# EAGLE board IGOR_1 (EAGLE 6.5.0)
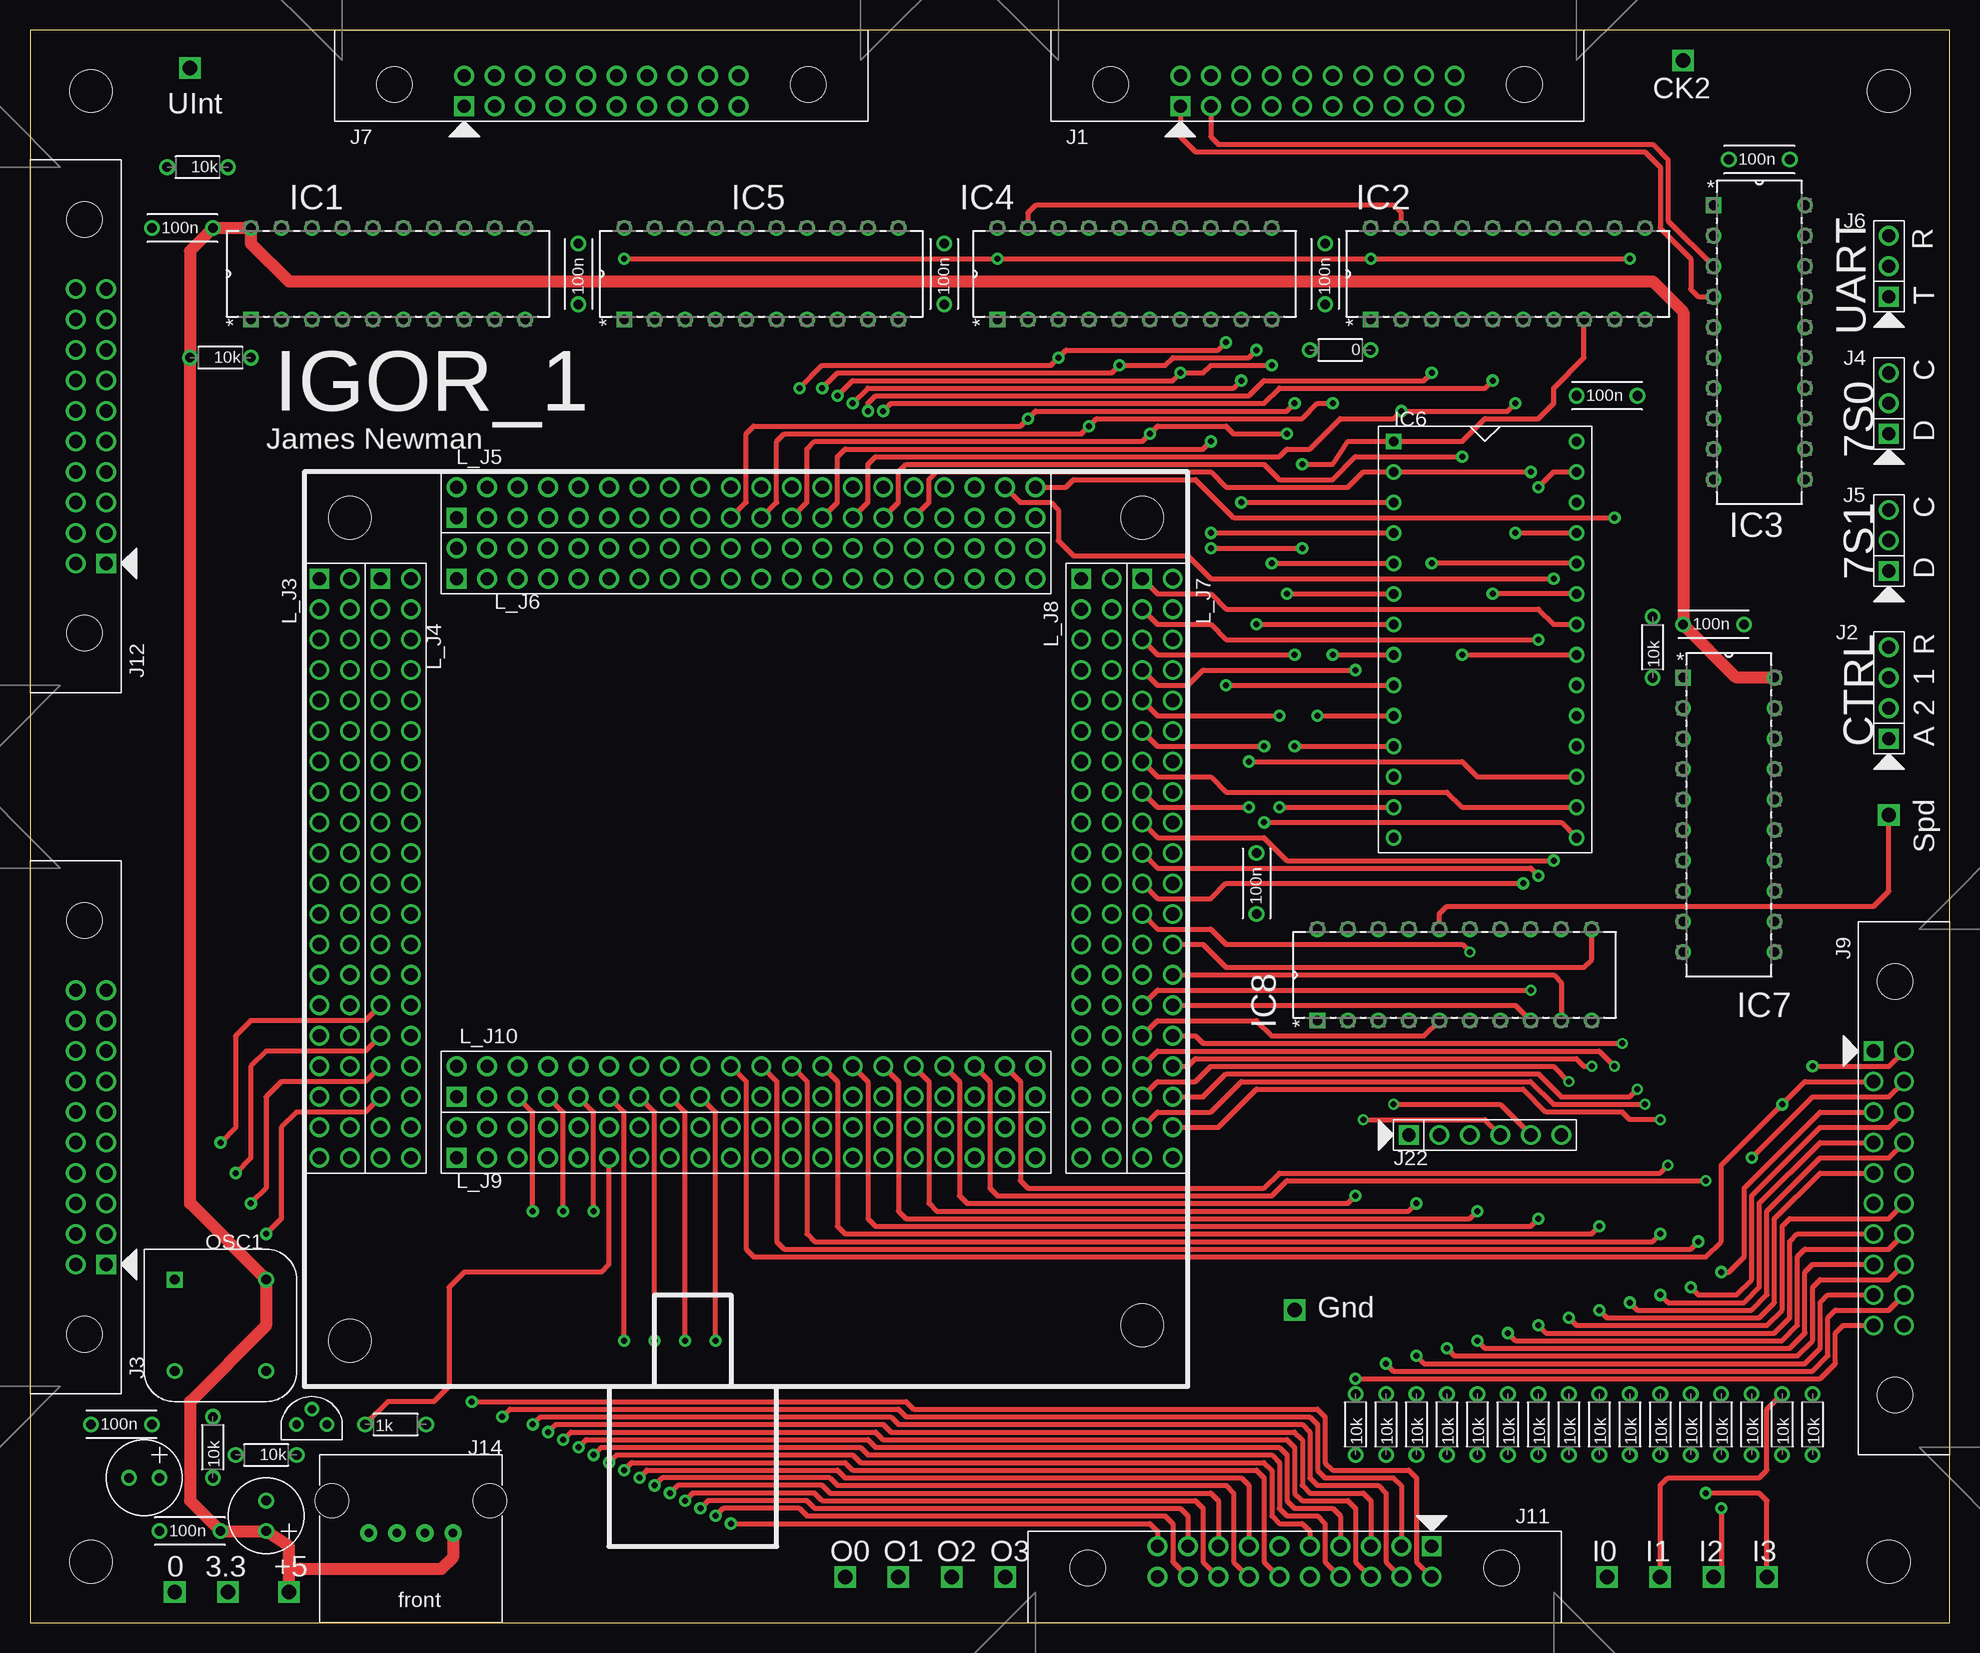
[diagram p12: board, top side]
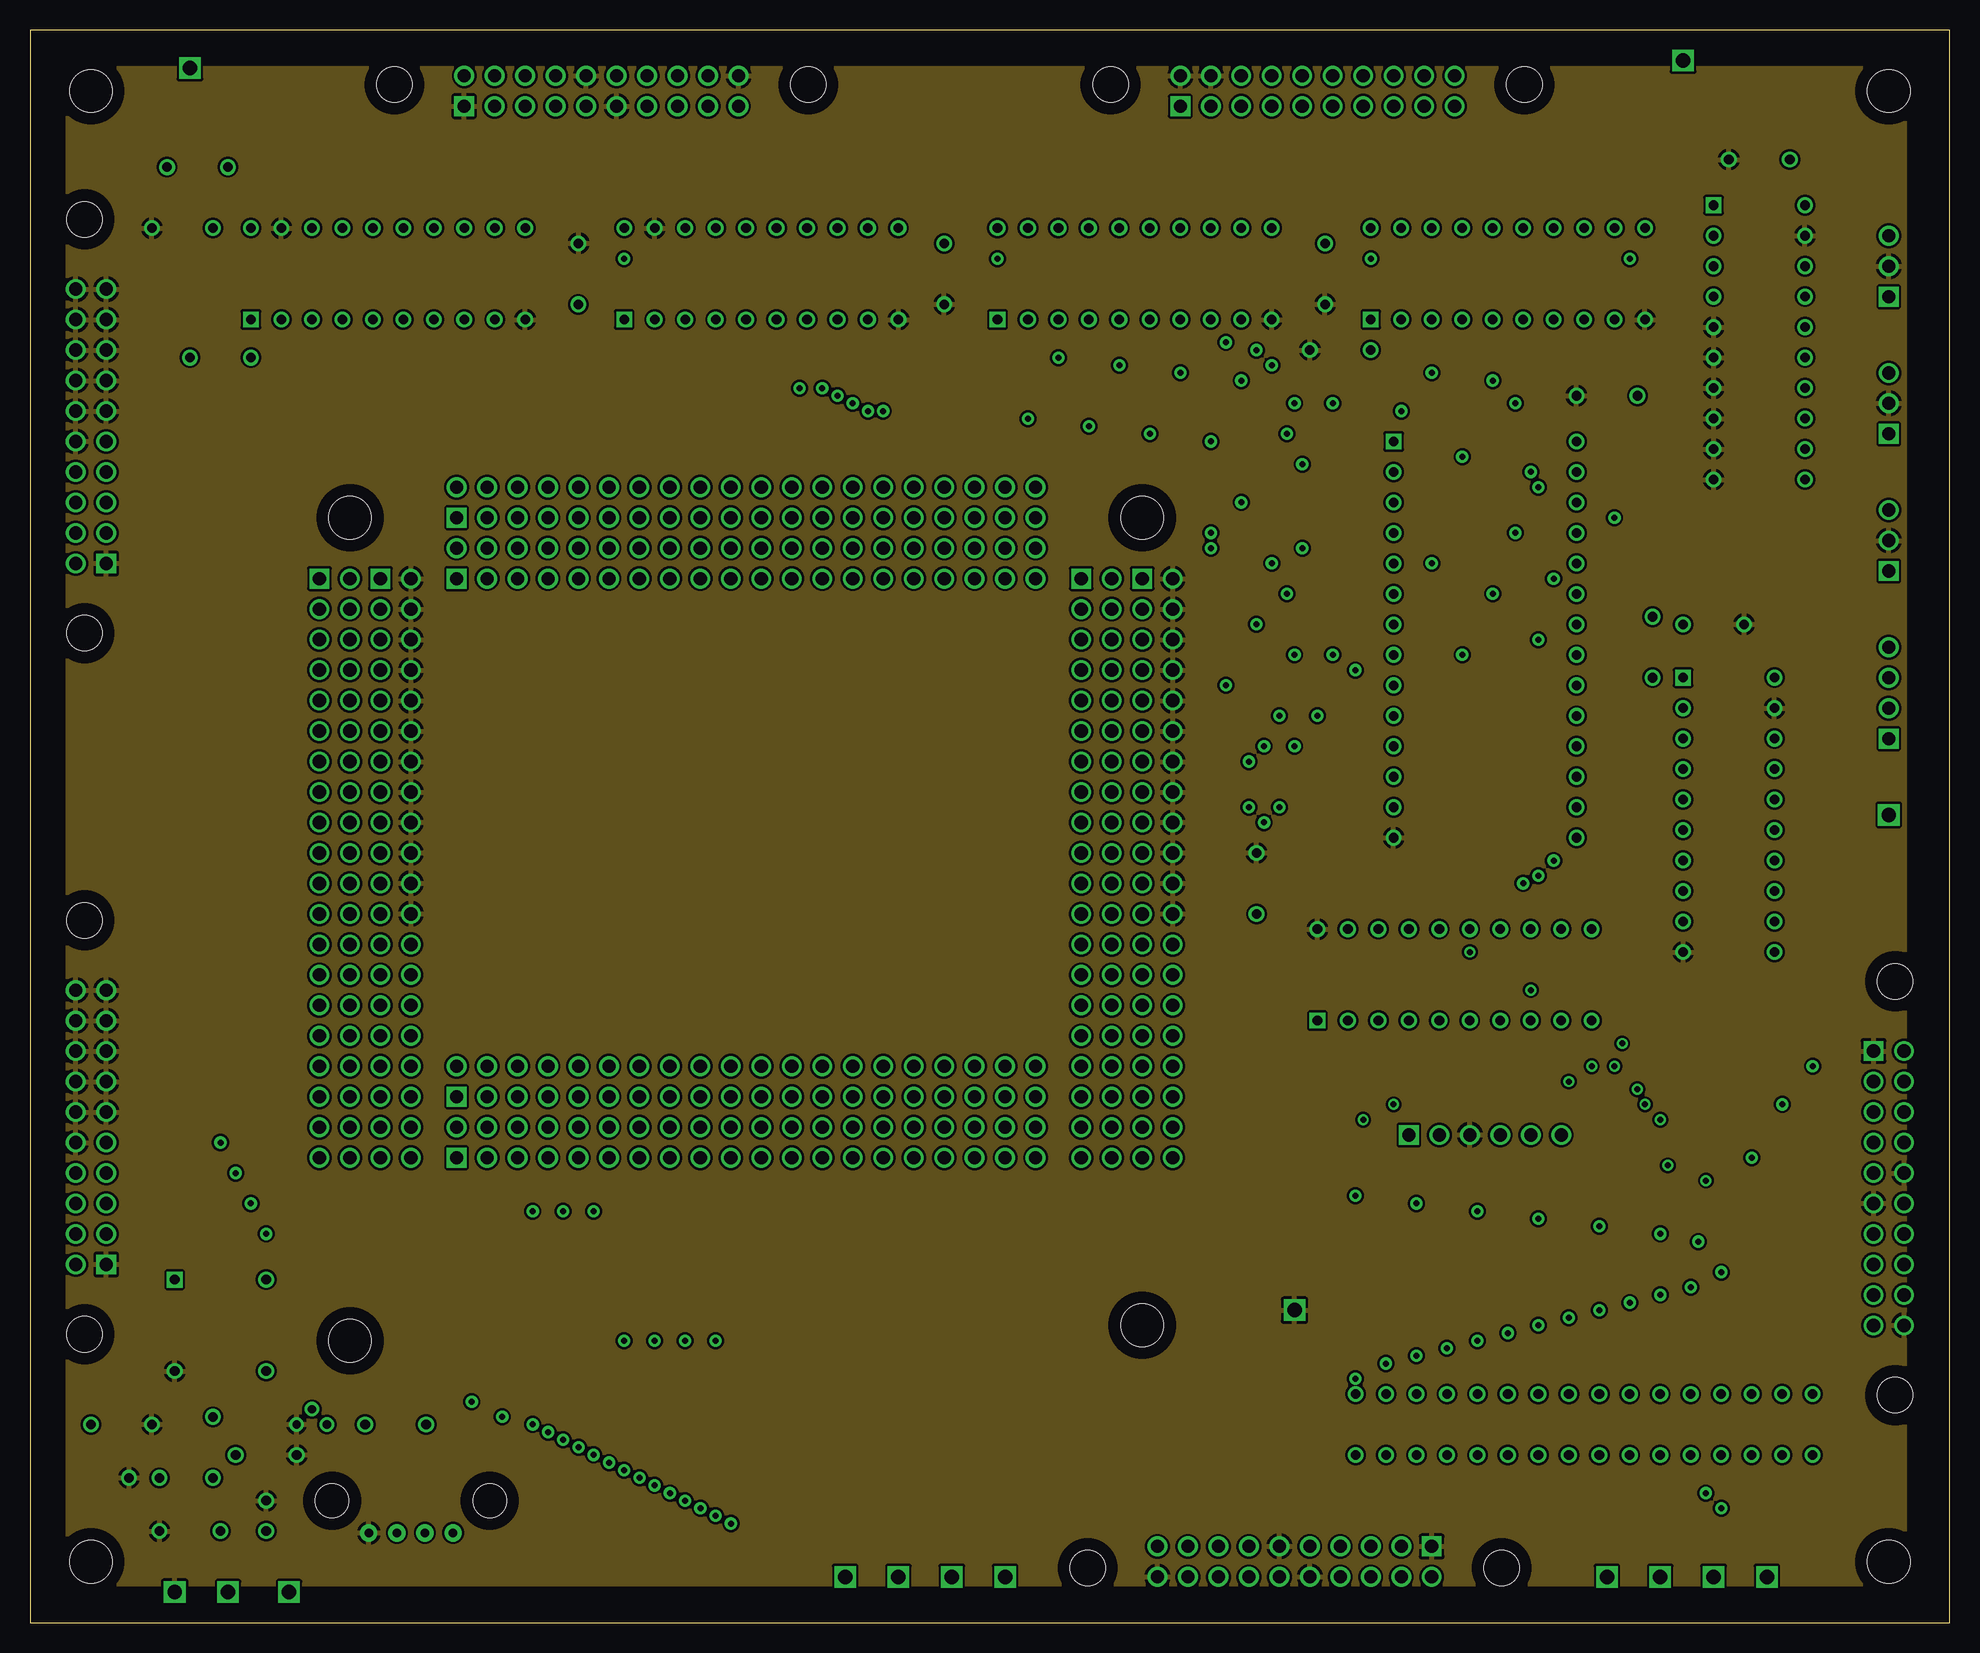
[diagram p13: board, inner layer Route2]
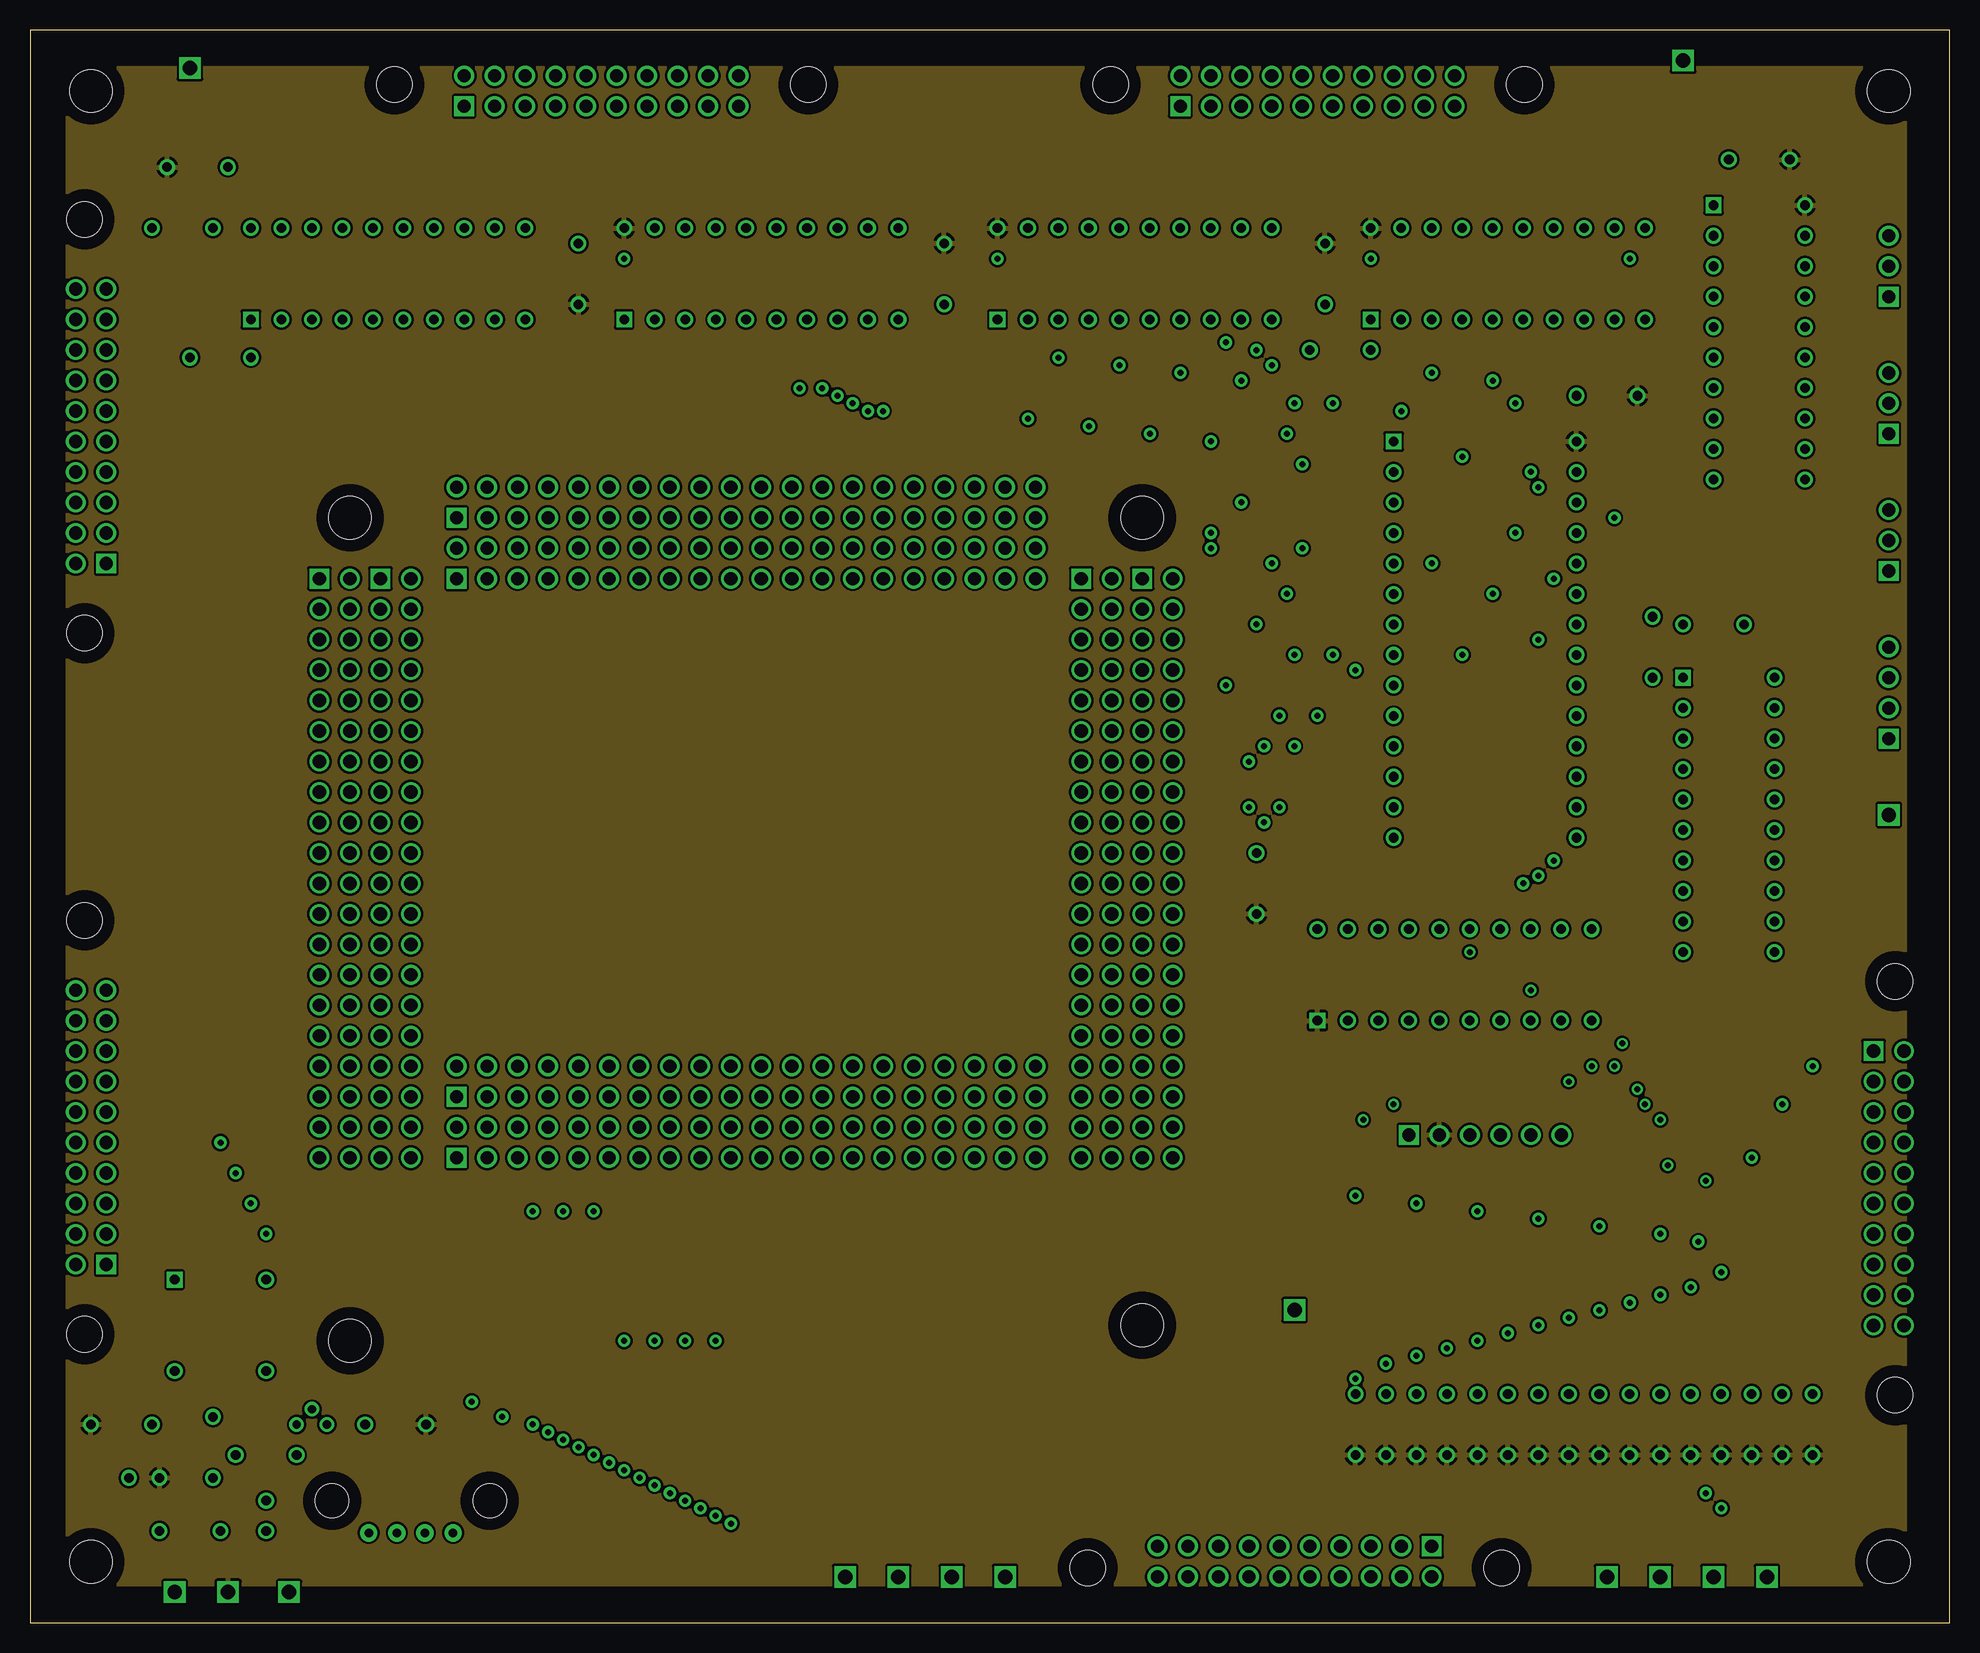
[diagram p14: board, inner layer Route3]
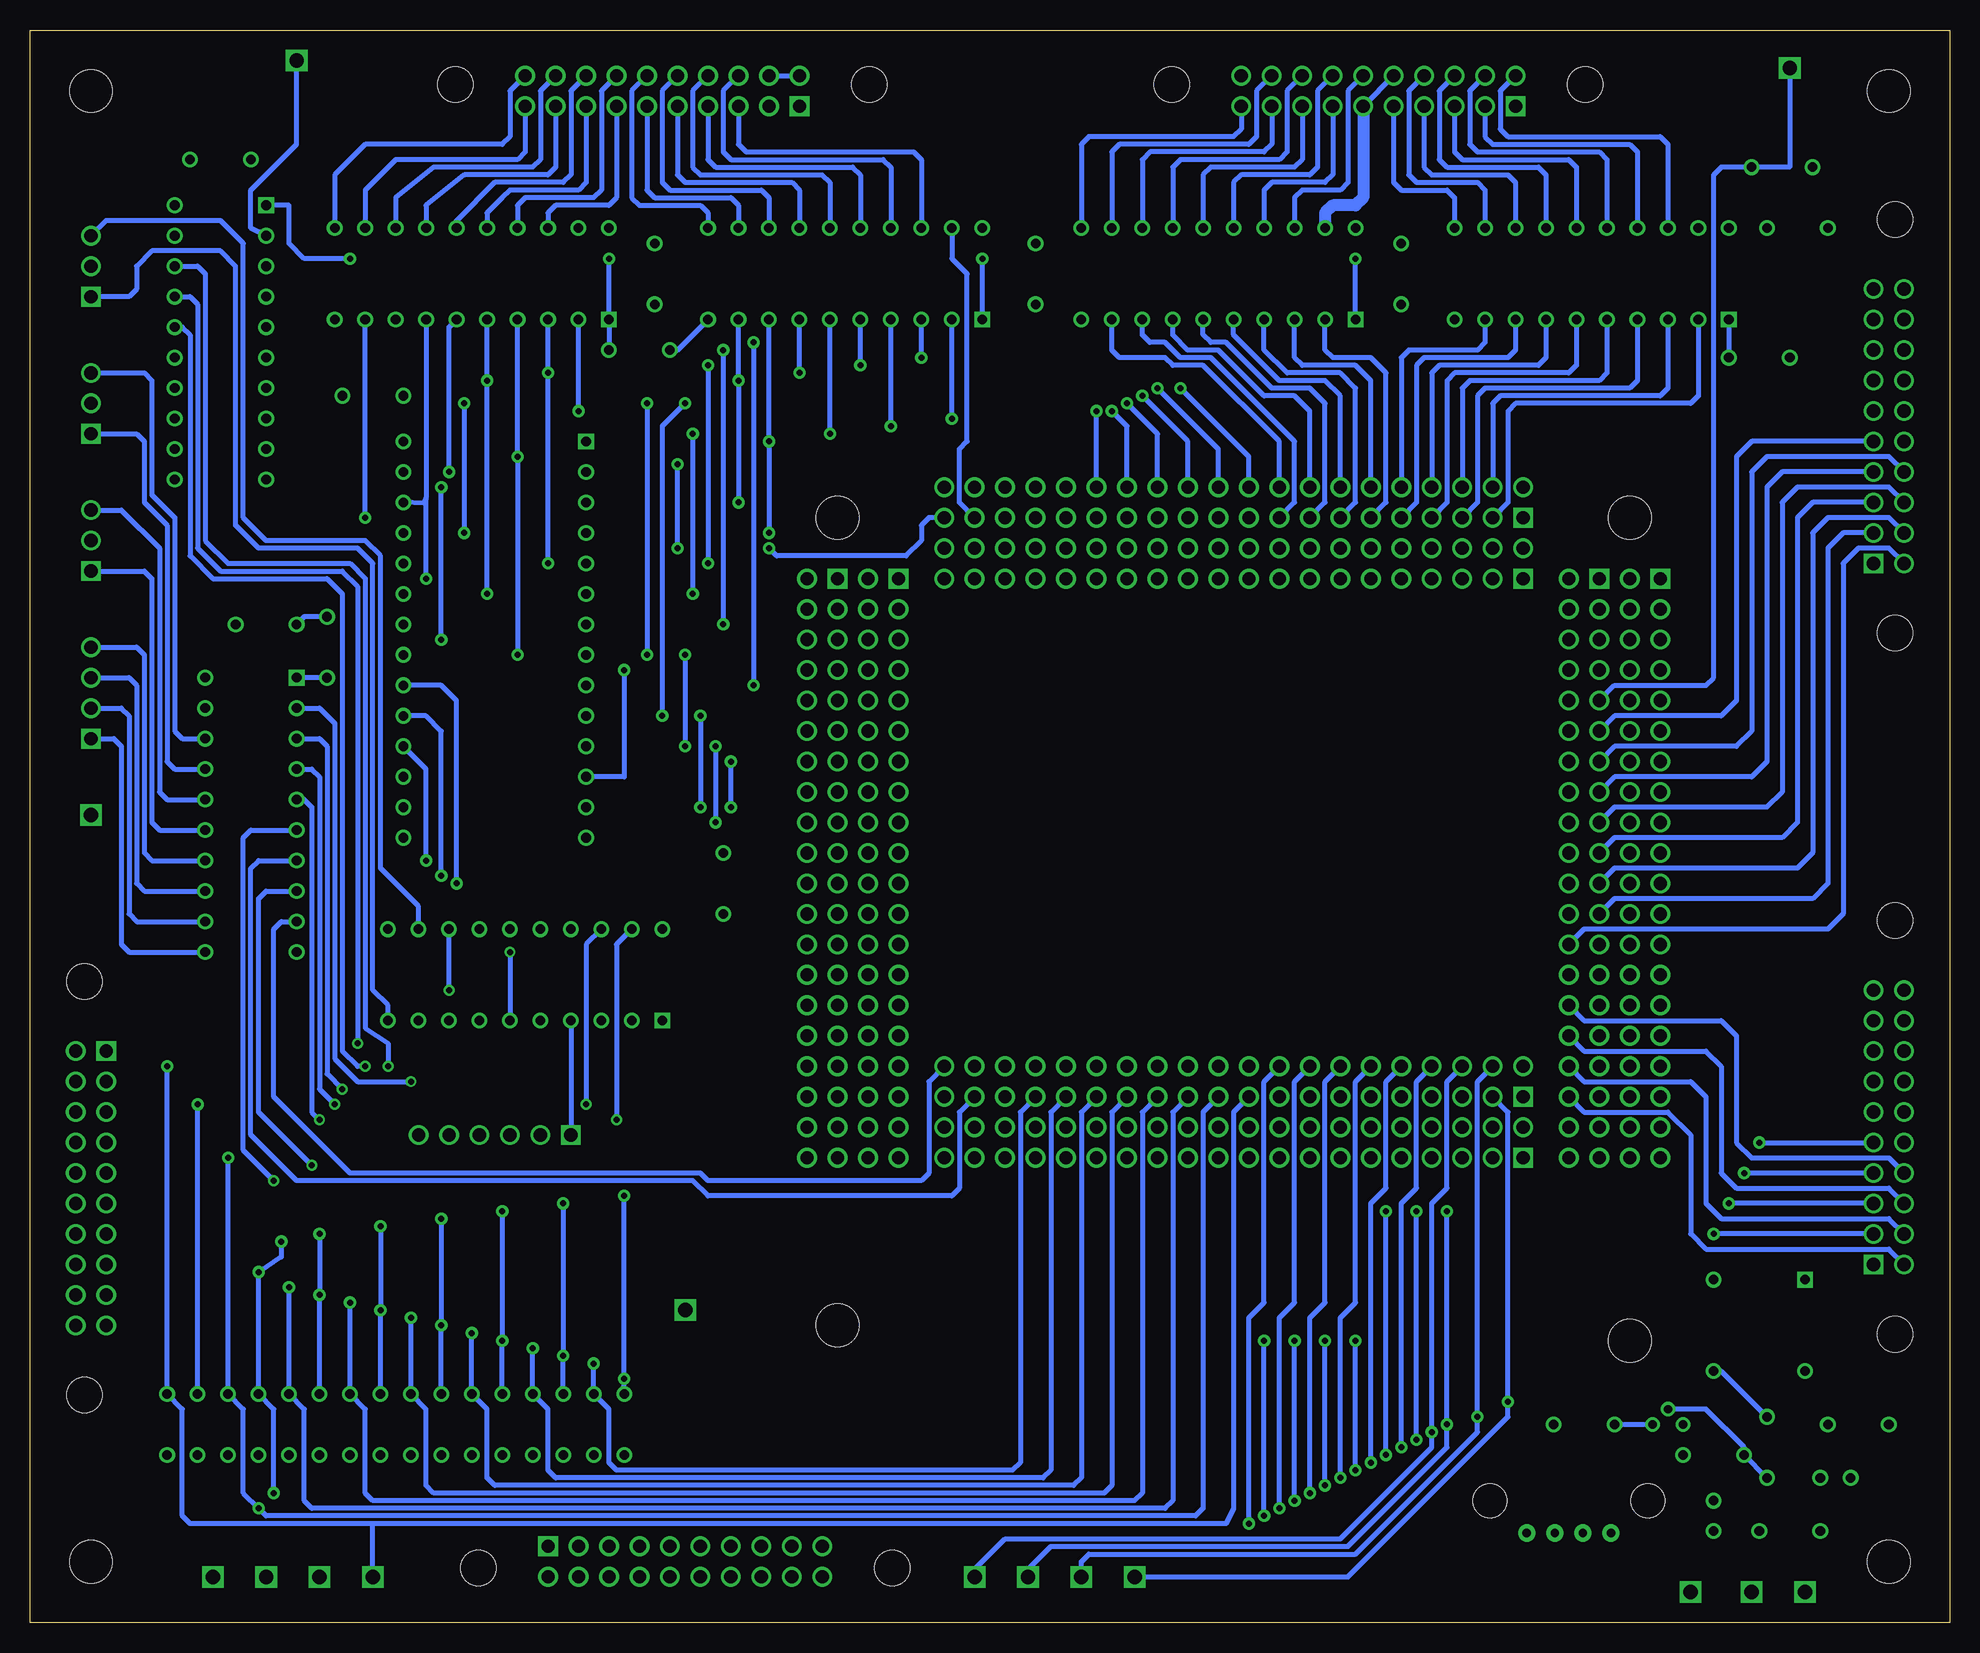
[diagram p15: board, bottom side, seen from below]

Size 160.02 x 132.72 mm. Coordinates in mm from the lower left corner, seen from the top.
Outline: 0,0 160.02,0 160.02,132.72 0,132.72 0,0
Copper layers (1*2+3*16): Top 0.035mm / dielectric 0.2mm / Route2 0.035mm / dielectric 1mm / Route3 0.035mm / dielectric 0.2mm / Bottom 0.035mm
Design rules "processor_rules_4layer": minimum track width 10mil, minimum drill 0.0236mm, track to track 8mil, track to pad 8mil, pad to pad 8mil, via to via 8mil, smd to smd 8mil, copper to edge 40mil, drill to drill 8mil, minimum pad ring 10mil, minimum via ring 8mil, stop-mask expansion 4mil, vias tented up to drill 0.7mm, thermal gap 10mil

## Footprints (pad centres in the part's own frame; a part is rotated, then mirrored left to right if it is on the bottom)
CAP_P2INCH = drill 0.8: 1 -2.54,0; 2 2.54,0
POLARISED_CAP_2P5_6P3MM = drill 0.8: A 1.27,0; K -1.27,0
3P5M_HOLE = hole 3.556: 0,0
DIP20 = drill 0.8 square: 1 -3.81,11.43 | drill 0.8: 2 -3.81,8.89; 3 -3.81,6.35; 4 -3.81,3.81; 5 -3.81,1.27; 6 -3.81,-1.27; 7 -3.81,-3.81; 8 -3.81,-6.35; 9 -3.81,-8.89; 10 -3.81,-11.43; 11 3.81,-11.43; 12 3.81,-8.89; 13 3.81,-6.35; 14 3.81,-3.81; 15 3.81,-1.27; 16 3.81,1.27; 17 3.81,3.81; 18 3.81,6.35; 19 3.81,8.89; 20 3.81,11.43
DIP28 = drill 0.8 square: 1 -7.62,16.51 | drill 0.8: 2 -7.62,13.97; 3 -7.62,11.43; 4 -7.62,8.89; 5 -7.62,6.35; 6 -7.62,3.81; 7 -7.62,1.27; 8 -7.62,-1.27; 9 -7.62,-3.81; 10 -7.62,-6.35; 11 -7.62,-8.89; 12 -7.62,-11.43; 13 -7.62,-13.97; 14 -7.62,-16.51; 15 7.62,-16.51; 16 7.62,-13.97; 17 7.62,-11.43; 18 7.62,-8.89; 19 7.62,-6.35; 20 7.62,-3.81; 21 7.62,-1.27; 22 7.62,1.27; 23 7.62,3.81; 24 7.62,6.35; 25 7.62,8.89; 26 7.62,11.43; 27 7.62,13.97; 28 7.62,16.51
20_HDR_LOCKING_RA = drill 1.1 square: 1 -11.43,-1.27 | drill 1.1: 2 -11.43,1.27; 3 -8.89,-1.27; 4 -8.89,1.27; 5 -6.35,-1.27; 6 -6.35,1.27; 7 -3.81,-1.27; 8 -3.81,1.27; 9 -1.27,-1.27; 10 -1.27,1.27; 11 1.27,-1.27; 12 1.27,1.27; 13 3.81,-1.27; 14 3.81,1.27; 15 6.35,-1.27; 16 6.35,1.27; 17 8.89,-1.27; 18 8.89,1.27; 19 11.43,-1.27; 20 11.43,1.27 | hole 2.946: -17.247,0.533; 17.247,0.533
JUMP_4X1 = drill 1.1 square: 1 -3.81,0 | drill 1.1: 2 -1.27,0; 3 1.27,0; 4 3.81,0
JUMP_3X1 = drill 1.1 square: 1 -2.54,0 | drill 1.1: 2 0,0; 3 2.54,0
USB_TYPE_A = drill 0.7 pad 1.422: 1 -3.505,0.152; 2 -1.168,0.152; 3 1.168,0.152; 4 3.505,0.152 | hole 2.8: -6.579,-2.54; 6.579,-2.54
JUMP_6X1 = drill 1.1 square: 1 -6.35,0 | drill 1.1: 2 -3.81,0; 3 -1.27,0; 4 1.27,0; 5 3.81,0; 6 6.35,0
JUMP_20X2 = drill 1.1 square: 1 -24.13,-1.27 | drill 1.1: 2 -24.13,1.27; 3 -21.59,-1.27; 4 -21.59,1.27; 5 -19.05,-1.27; 6 -19.05,1.27; 7 -16.51,-1.27; 8 -16.51,1.27; 9 -13.97,-1.27; 10 -13.97,1.27; 11 -11.43,-1.27; 12 -11.43,1.27; 13 -8.89,-1.27; 14 -8.89,1.27; 15 -6.35,-1.27; 16 -6.35,1.27; 17 -3.81,-1.27; 18 -3.81,1.27; 19 -1.27,-1.27; 20 -1.27,1.27; 21 1.27,-1.27; 22 1.27,1.27; 23 3.81,-1.27; 24 3.81,1.27; 25 6.35,-1.27; 26 6.35,1.27; 27 8.89,-1.27; 28 8.89,1.27; 29 11.43,-1.27; 30 11.43,1.27; 31 13.97,-1.27; 32 13.97,1.27; 33 16.51,-1.27; 34 16.51,1.27; 35 19.05,-1.27; 36 19.05,1.27; 37 21.59,-1.27; 38 21.59,1.27; 39 24.13,-1.27; 40 24.13,1.27
OSC_12P9_MM = drill 0.8 square: 1 -3.81,3.81 | drill 0.8: 4 -3.81,-3.81; 5 3.81,-3.81; 8 3.81,3.81
TO92-DGS = drill 0.7: D 0,1.27; G -1.27,0; S 0,-1.27
R_P2INCH = drill 0.8: 1 -2.54,0; 2 2.54,0
TEST_LOOP = drill 1.2 square: P$1 0,0

## Placement (x,y rotation side)
C1  100n  [CAP_P2INCH]  140.34,83.19 0 top
C4  100n  [CAP_P2INCH]  45.72,112.39 90 top
C5  100n  [CAP_P2INCH]  76.2,112.39 90 top
C7  100n  [CAP_P2INCH]  144.15,121.92 0 top
C8  100n  [CAP_P2INCH]  102.23,61.59 90 top
C9  100n  [CAP_P2INCH]  12.7,116.2 0 top
C10  100n  [CAP_P2INCH]  7.62,16.51 0 top
C11  100n  [CAP_P2INCH]  131.44,102.23 0 top
C12  100n  [CAP_P2INCH]  107.95,112.39 90 top
C13  100u  [POLARISED_CAP_2P5_6P3MM]  9.53,12.06 0 top
C14  100u  [POLARISED_CAP_2P5_6P3MM]  19.68,8.89 270 top
C15  100n  [CAP_P2INCH]  13.34,7.62 0 top
HOLE1  3M5_MOUNT_HOLE  [3P5M_HOLE]  92.71,24.77 0 top
HOLE2  3M5_MOUNT_HOLE  [3P5M_HOLE]  5.08,127.64 0 top
HOLE3  3M5_MOUNT_HOLE  [3P5M_HOLE]  154.94,127.64 0 top
HOLE4  3M5_MOUNT_HOLE  [3P5M_HOLE]  154.94,5.08 0 top
HOLE5  3M5_MOUNT_HOLE  [3P5M_HOLE]  26.67,23.5 0 top
HOLE6  3M5_MOUNT_HOLE  [3P5M_HOLE]  26.67,92.08 0 top
HOLE7  3M5_MOUNT_HOLE  [3P5M_HOLE]  92.71,92.08 0 top
HOLE8  3M5_MOUNT_HOLE  [3P5M_HOLE]  5.08,5.08 0 top
IC1  74ahct245  [DIP20]  29.84,112.39 90 top
IC2  74LVC245  [DIP20]  123.19,112.39 90 top
IC3  74LVC245  [DIP20]  144.15,106.68 0 top
IC4  74LVC245  [DIP20]  92.08,112.39 90 top
IC5  74LVC245  [DIP20]  60.96,112.39 90 top
IC6  ly62256  [DIP28]  121.28,81.92 0 top
IC7  74ahct245  [DIP20]  141.6,67.31 0 top
IC8  PIC16F1509-E/P  [DIP20]  118.75,53.98 90 top
J1  20_HDR_LOCKING_RA  [20_HDR_LOCKING_RA]  107.31,127.64 0 top
J2  JUMP_4X1  [JUMP_4X1]  154.94,77.47 90 top
J3  20_HDR_LOCKING_RA  [20_HDR_LOCKING_RA]  5.08,41.27 90 top
J4  JUMP_3X1  [JUMP_3X1]  154.94,101.6 90 top
J5  JUMP_3X1  [JUMP_3X1]  154.94,90.17 90 top
J6  JUMP_3X1  [JUMP_3X1]  154.94,113.03 90 top
J7  20_HDR_LOCKING_RA  [20_HDR_LOCKING_RA]  47.62,127.64 0 top
J9  20_HDR_LOCKING_RA  [20_HDR_LOCKING_RA]  154.94,36.2 270 top
J11  20_HDR_LOCKING_RA  [20_HDR_LOCKING_RA]  105.41,5.08 180 top
J12  20_HDR_LOCKING_RA  [20_HDR_LOCKING_RA]  5.08,99.69 90 top
J14  [USB_TYPE_A]  31.75,7.62 180 top
J22  JUMP_6X1  [JUMP_6X1]  121.28,40.64 0 top
L_J3  [JUMP_20X2]  25.4,62.87 270 top
L_J4  [JUMP_20X2]  30.48,62.87 270 top
L_J5  [JUMP_20X2]  59.69,93.34 0 top
L_J6  [JUMP_20X2]  59.69,88.27 0 top
L_J7  [JUMP_20X2]  93.98,62.87 270 top
L_J8  [JUMP_20X2]  88.9,62.87 270 top
L_J9  [JUMP_20X2]  59.69,40.01 0 top
L_J10  [JUMP_20X2]  59.69,45.09 0 top
OSC1  [OSC_12P9_MM]  15.88,24.77 0 top
Q1  2N7000  [TO92-DGS]  23.5,16.51 270 top
R1  10k  [R_P2INCH]  15.24,14.61 90 top
R2  1k  [R_P2INCH]  30.48,16.51 0 top
R3  10k  [R_P2INCH]  19.68,13.97 180 top
R5  10k  [R_P2INCH]  135.25,81.28 90 top
R39  10k  [R_P2INCH]  13.97,121.28 180 top
R40  0  [R_P2INCH]  109.22,106.05 180 top
R41  10k  [R_P2INCH]  15.88,105.41 180 top
R51  10k  [R_P2INCH]  110.49,16.51 90 top
R52  10k  [R_P2INCH]  113.03,16.51 90 top
R53  10k  [R_P2INCH]  115.57,16.51 90 top
R54  10k  [R_P2INCH]  118.11,16.51 90 top
R55  10k  [R_P2INCH]  120.65,16.51 90 top
R56  10k  [R_P2INCH]  123.19,16.51 90 top
R57  10k  [R_P2INCH]  125.73,16.51 90 top
R58  10k  [R_P2INCH]  128.27,16.51 90 top
R59  10k  [R_P2INCH]  130.81,16.51 90 top
R60  10k  [R_P2INCH]  133.35,16.51 90 top
R61  10k  [R_P2INCH]  135.89,16.51 90 top
R62  10k  [R_P2INCH]  138.43,16.51 90 top
R63  10k  [R_P2INCH]  140.97,16.51 90 top
R64  10k  [R_P2INCH]  143.51,16.51 90 top
R65  10k  [R_P2INCH]  146.05,16.51 90 top
R66  10k  [R_P2INCH]  148.59,16.51 90 top
TP1  [TEST_LOOP]  21.59,2.54 0 top
TP2  [TEST_LOOP]  13.34,129.54 0 top
TP3  [TEST_LOOP]  137.79,130.18 270 top
TP4  [TEST_LOOP]  67.94,3.81 90 top
TP5  [TEST_LOOP]  72.39,3.81 90 top
TP6  [TEST_LOOP]  76.83,3.81 90 top
TP7  [TEST_LOOP]  16.51,2.54 0 top
TP8  [TEST_LOOP]  12.06,2.54 0 top
TP9  [TEST_LOOP]  81.28,3.81 90 top
TP10  [TEST_LOOP]  154.94,67.31 0 top
TP11  [TEST_LOOP]  131.44,3.81 90 top
TP12  [TEST_LOOP]  135.89,3.81 90 top
TP13  [TEST_LOOP]  140.34,3.81 90 top
TP14  [TEST_LOOP]  144.78,3.81 90 top
TP15  [TEST_LOOP]  105.41,26.04 0 top

## Tracks (layer width: path | path; a pad name or v marks a point on that pad's centre or on a via)
3V3_A0  (via drill 0.5 pad 1.02)
  Top 0.406: L_J5.19 59.69,93.34 59.69,99.06 60.33,99.69 82.55,99.69 v83.19,100.33 83.82,100.97 104.78,100.97 v105.41,101.6 | v107.31,75.56 IC6.10
  Bottom 0.406: v83.19,100.33 IC4.2 | v105.41,101.6 107.31,99.69 v107.31,75.56
3V3_A1  (via drill 0.5 pad 1.02)
  Top 0.406: v64.14,102.87 66.04,104.78 85.09,104.78 v85.72,105.41 86.36,106.05 99.06,106.05 v99.69,106.68 | v99.69,78.11 IC6.9
  Bottom 0.406: L_J5.20 58.42,97.16 v64.14,102.87 | v85.72,105.41 IC4.3 | v99.69,106.68 v99.69,78.11
3V3_A2  (via drill 0.5 pad 1.02)
  Top 0.406: L_J5.21 62.23,93.34 62.23,98.42 62.87,99.06 87.63,99.06 v88.27,99.69 88.9,100.33 106.05,100.33 107.31,101.6 v108.58,101.6 | v108.58,80.64 IC6.8
  Bottom 0.406: v88.27,99.69 IC4.4 | v108.58,101.6 v108.58,80.64
3V3_A3  (via drill 0.5 pad 1.02)
  Top 0.406: v66.04,102.87 67.31,104.14 90.17,104.14 v90.81,104.78 94.61,104.78 95.25,105.41 101.6,105.41 v102.23,106.05 | v102.23,83.19 IC6.7
  Bottom 0.406: L_J5.22 60.96,97.79 v66.04,102.87 | v90.81,104.78 IC4.5 | v102.23,106.05 v102.23,83.19
3V3_A4  (via drill 0.5 pad 1.02)
  Top 0.406: L_J5.23 64.77,93.34 64.77,97.79 65.41,98.42 92.71,98.42 v93.34,99.06 93.98,99.69 99.69,99.69 100.33,99.06 v104.78,99.06 | v104.78,85.72 IC6.6
  Bottom 0.406: v93.34,99.06 IC4.6 | v104.78,99.06 v104.78,85.72
3V3_A5  (via drill 0.5 pad 1.02)
  Top 0.406: v67.31,102.23 68.58,103.5 95.25,103.5 v95.89,104.14 97.79,104.14 98.42,104.78 v103.5,104.78 | v103.5,88.27 IC6.5
  Bottom 0.406: L_J5.24 63.5,98.42 v67.31,102.23 | v95.89,104.14 IC4.7 | v103.5,104.78 v103.5,88.27
3V3_A6  (via drill 0.5 pad 1.02)
  Top 0.406: L_J5.25 67.31,93.34 67.31,97.16 67.94,97.79 97.79,97.79 v98.42,98.42 | v98.42,90.81 IC6.4
  Bottom 0.406: IC4.8 v98.42,98.42 v98.42,90.81
3V3_A7  (via drill 0.5 pad 1.02)
  Top 0.406: v68.58,101.6 69.85,102.87 100.33,102.87 v100.97,103.5 | v100.97,93.34 IC6.3
  Bottom 0.406: L_J5.26 66.04,99.06 v68.58,101.6 | IC4.9 v100.97,103.5 v100.97,93.34
3V3_A8  (via drill 0.5 pad 1.02)
  Top 0.406: L_J5.27 69.85,93.34 69.85,96.52 70.48,97.16 104.14,97.16 104.78,97.79 106.68,97.79 109.22,100.33 113.67,100.33 v114.3,100.97 123.19,100.97 v123.83,101.6 | v123.83,90.81 IC6.25
  Bottom 0.406: v114.3,100.97 IC2.2 | v123.83,101.6 v123.83,90.81
3V3_A9  (via drill 0.5 pad 1.02)
  Top 0.406: v69.85,100.97 69.85,101.6 70.48,102.23 101.6,102.23 102.87,103.5 116.2,103.5 v116.84,104.14 | IC6.24 v116.84,88.27
  Bottom 0.406: L_J5.28 68.58,99.69 v69.85,100.97 | IC2.3 v116.84,104.14 v116.84,88.27
3V3_A10  (via drill 0.5 pad 1.02)
  Top 0.406: L_J5.29 72.39,93.34 72.39,95.89 73.03,96.52 102.87,96.52 104.14,95.25 108.58,95.25 110.49,97.16 v119.38,97.16 | v119.38,80.64 IC6.21
  Bottom 0.406: IC2.4 v119.38,97.16 v119.38,80.64
3V3_A11  (via drill 0.5 pad 1.02)
  Top 0.406: v71.12,100.97 71.75,101.6 102.87,101.6 104.14,102.87 121.28,102.87 v121.92,103.5 | IC6.23 v121.92,85.72
  Bottom 0.406: L_J5.30 v71.12,100.97 | IC2.5 v121.92,103.5 v121.92,85.72
3V3_A12  (via drill 0.5 pad 1.02)
  Top 0.406: L_J5.31 74.93,93.34 74.93,95.25 75.56,95.89 98.42,95.89 99.69,94.61 109.86,94.61 111.12,95.89 IC6.2 v125.09,95.89
  Bottom 0.406: v125.09,95.89 125.09,107.95 IC2.6
3V3_A13  (via drill 0.5 pad 1.02)
  Top 0.406: L_J5.38 82.55,93.34 85.09,93.34 85.72,92.71 85.72,90.17 87,88.9 96.52,88.9 98.42,87 v127,87
  Bottom 0.406: IC2.7 127,93.73 | 127,93.34 127.19,93.28 | 127.19,93.28 IC6.26 | v127,87 127,93.34 | 127,93.34 127,93.73 | 127,93.73 127.19,93.28
3V3_A14  (via drill 0.5 pad 1.02)
  Top 0.406: v98.42,89.53 v106.05,89.53 | v106.05,96.52 108.58,96.52 109.86,98.42 IC6.1 119.38,98.42 121.28,100.33 125.73,100.33 127,101.6 127,102.87 129.54,105.41 IC2.8
  Bottom 0.406: L_J5.39 85.09,92.08 85.72,91.44 85.72,90.17 87,88.9 97.79,88.9 v98.42,89.53 | v106.05,89.53 v106.05,96.52
3V3_A15  (via drill 0.5 pad 1.02)
  Top 0.406: L_J5.40 86.36,94.61 87,95.25 97.16,95.25 100.33,92.08 v132.08,92.08
  Bottom 0.406: v132.08,92.08 IC2.9
3V3_CK2  (via drill 0.5 pad 0.41)
  Top 0.406: L_J7.34 96.52,46.35 97.16,46.99 128.91,46.99 129.54,46.35 v130.18,46.35
  Bottom 0.406: IC3.18 146.05,113.03 145.41,112.39 145.41,90.17 143.51,88.27 133.35,88.27 132.08,87 132.08,49.53 130.18,48.26 v130.18,46.35
3V3_CS_N  (via drill 0.5 pad 0.41)
  Top 0.406: L_J7.33 93.98,47.62 130.81,47.62 v132.08,46.35
  Bottom 0.406: IC3.16 147.32,107.95 146.69,107.31 146.69,88.9 144.78,87 135.25,87 133.99,85.72 133.99,47.62 132.72,46.35 v132.08,46.35
3V3_D0  (via drill 0.5 pad 1.02)
  Top 0.406: L_J7.5 93.98,80.64 v105.41,80.64 | v105.41,73.03 IC6.11
  Bottom 0.406: v105.41,80.64 v105.41,73.03
3V3_D1  (via drill 0.5 pad 1.02)
  Top 0.406: L_J7.7 93.98,78.11 96.52,78.11 97.79,79.38 v110.49,79.38
  Bottom 0.406: v110.49,79.38 110.49,70.48 IC6.12
3V3_D2  (via drill 0.5 pad 1.02)
  Top 0.406: L_J7.9 93.98,75.56 v104.14,75.56 | v104.14,67.94 IC6.13
  Bottom 0.406: v104.14,75.56 v104.14,67.94
3V3_D3  (via drill 0.5 pad 1.02)
  Top 0.406: L_J7.11 93.98,73.03 v102.87,73.03 | v102.87,66.67 127.64,66.67 IC6.15
  Bottom 0.406: v102.87,73.03 v102.87,66.67
3V3_D4
  Top 0.406: L_J7.13 93.98,70.48 98.42,70.48 99.69,69.22 118.11,69.22 119.38,67.94 IC6.16
3V3_D5  (via drill 0.5 pad 1.02)
  Top 0.406: L_J7.15 93.98,67.94 v101.6,67.94 | v101.6,71.75 119.38,71.75 120.65,70.48 IC6.17
  Bottom 0.406: v101.6,67.94 v101.6,71.75
3V3_D6  (via drill 0.5 pad 1.02)
  Top 0.406: L_J7.17 93.98,65.41 102.87,65.41 104.78,63.5 v127,63.5
  Bottom 0.406: v127,63.5 127,71.12 IC6.18
3V3_D7  (via drill 0.5 pad 1.02)
  Top 0.406: L_J7.19 93.98,62.87 125.09,62.87 v125.73,62.23
  Bottom 0.406: v125.73,62.23 125.73,74.3 127,75.56 IC6.19
3V3_RD0
  Bottom 0.406: IC1.2 20.95,102.23 21.59,101.6 36.2,101.6 36.83,100.97 36.83,93.34 L_J5.3
3V3_RD1
  Bottom 0.406: IC1.3 23.5,102.87 24.13,102.23 37.47,102.23 38.1,101.6 L_J5.4
3V3_RD2
  Bottom 0.406: IC1.4 26.04,103.5 26.67,102.87 38.73,102.87 39.37,102.23 39.37,93.34 L_J5.5
3V3_RD3
  Bottom 0.406: IC1.5 28.57,104.14 29.21,103.5 40.01,103.5 40.64,102.87 L_J5.6
3V3_RD4
  Bottom 0.406: IC1.6 31.11,104.78 31.75,104.14 41.27,104.14 41.91,103.5 41.91,93.34 L_J5.7
3V3_RD5
  Bottom 0.406: IC1.7 33.66,105.41 34.29,104.78 42.55,104.78 43.18,104.14 L_J5.8
3V3_RD6
  Bottom 0.406: IC1.8 36.2,106.05 36.83,105.41 43.81,105.41 44.45,104.78 44.45,93.34 L_J5.9
3V3_RD7
  Bottom 0.406: IC1.9 38.73,106.68 39.37,106.05 45.09,106.05 45.72,105.41 L_J5.10
3V3_WD0
  Bottom 0.406: L_J5.11 46.99,93.34 46.99,104.14 48.26,105.41 51.44,105.41 52.07,106.05 IC5.2
3V3_WD1
  Bottom 0.406: L_J5.12 48.26,103.5 49.53,104.78 53.98,104.78 54.61,105.41 IC5.3
3V3_WD2
  Bottom 0.406: L_J5.13 49.53,93.34 49.53,102.87 50.8,104.14 55.24,104.14 57.15,106.05 IC5.4
3V3_WD3
  Bottom 0.406: L_J5.14 50.8,102.23 52.07,103.5 55.88,103.5 59.69,107.31 IC5.5
3V3_WD4
  Bottom 0.406: L_J5.15 52.07,93.34 52.07,101.6 53.34,102.87 56.52,102.87 60.33,106.68 61.59,106.68 62.23,107.31 IC5.6
3V3_WD5
  Bottom 0.406: L_J5.16 53.34,100.97 54.61,102.23 57.15,102.23 60.96,106.05 63.5,106.05 64.77,107.31 IC5.7
3V3_WD6
  Bottom 0.406: L_J5.17 54.61,93.34 54.61,98.42 61.59,105.41 64.14,105.41 65.41,106.68 66.67,106.68 67.31,107.31 IC5.8
3V3_WD7
  Bottom 0.406: L_J5.18 55.88,98.42 62.23,104.78 64.77,104.78 65.41,105.41 69.22,105.41 69.85,106.05 IC5.9
3V3_WRITE_N  (via drill 0.5 pad 0.41)
  Top 0.406: L_J7.32 97.16,48.9 97.79,48.26 v132.72,48.26
  Bottom 0.406: IC3.17 146.69,110.49 146.05,109.86 146.05,89.53 144.15,87.63 133.99,87.63 132.72,86.36 v132.72,48.26
!ADD_BUF_EN
  Top 0.406: IC2.19 114.3,117.47 113.67,118.11 83.82,118.11 83.19,117.47 IC4.19
  Bottom 0.406: L_J5.37 82.55,93.34 82.55,97.79 81.92,98.42 81.92,112.39 83.19,113.67 IC4.19
!RAM_CS  (via drill 0.5 pad 1.02)
  Top 0.406: L_J7.21 93.98,60.33 98.42,60.33 99.69,61.59 v124.46,61.59
  Bottom 0.406: v124.46,61.59 124.46,76.83 125.73,78.11 IC6.20
!RAM_OE
  Top 0.406: L_J7.1 93.98,85.72 98.42,85.72 99.69,84.45 125.73,84.45 127,83.19 IC6.22
!RAM_WE  (via drill 0.5 pad 1.02)
  Top 0.406: L_J7.3 93.98,83.19 98.42,83.19 99.69,81.92 v125.73,81.92 | v125.73,94.61 127,95.89 IC6.27
  Bottom 0.406: v125.73,81.92 v125.73,94.61
!SPI_SS1
  Top 0.406: L_J7.30 123.83,51.44 IC8.8
!SPI_SS2
  Top 0.406: L_J7.31 93.98,50.16 102.23,50.16 103.5,48.9 116.2,48.9 IC8.5
+3V3
  pour Route3: 3.17,129.54 156.21,129.54 156.21,3.17 3.17,3.17
+5V
  Top 1.016: IC7.20 142.24,78.74 C1.1 137.79,109.22 135.25,111.76 21.59,111.76 18.41,114.94 IC1.20 C9.2 13.34,114.3 R41.2 13.34,34.92 OSC1.8 19.68,24.77 13.34,18.41 13.34,10.16 C15.2 C14.A 21.59,6.35 21.59,4.45 | TP1.P$1 21.59,4.45 | J14.1 35.26,5.41 34.29,4.45 21.59,4.45
  Bottom 0.406: R5.2 137.16,83.82 C1.1
A0
  Bottom 0.406: J1.5 100.97,123.19 100.33,122.56 86.36,122.56 85.72,121.92 IC4.18
A1
  Bottom 0.406: J1.6 102.23,127.64 102.23,122.56 101.6,121.92 88.9,121.92 88.27,121.28 IC4.17
A2
  Bottom 0.406: J1.7 103.5,121.92 102.87,121.28 91.44,121.28 90.81,120.65 IC4.16
A3
  Bottom 0.406: J1.8 104.78,127.64 104.78,121.28 104.14,120.65 93.98,120.65 93.34,120.02 IC4.15
A4
  Bottom 0.406: J1.9 106.05,120.65 105.41,120.02 96.52,120.02 95.89,119.38 IC4.14
A5
  Bottom 0.406: J1.10 107.31,127.64 107.31,120.02 106.68,119.38 99.06,119.38 98.42,118.75 IC4.13
A6
  Bottom 0.406: J1.11 108.58,119.38 107.95,118.75 101.6,118.75 100.97,118.11 IC4.12
A7
  Bottom 0.406: J1.12 109.86,127.64 109.86,118.75 109.22,118.11 104.14,118.11 103.5,117.47 IC4.11
A8
  Bottom 0.406: J1.13 111.12,118.75 111.76,118.11 116.2,118.11 116.84,117.47 IC2.18
A9
  Bottom 0.406: J1.14 112.39,127.64 112.39,119.38 113.03,118.75 118.75,118.75 119.38,118.11 IC2.17
A10
  Bottom 0.406: J1.15 113.67,120.02 114.3,119.38 120.02,119.38 120.65,118.75 121.92,117.47 IC2.16
A11
  Bottom 0.406: J1.16 114.94,127.64 114.94,120.65 115.57,120.02 121.28,120.02 124.46,116.84 IC2.15
A12
  Bottom 0.406: J1.17 116.2,121.28 116.84,120.65 123.83,120.65 127,118.11 IC2.14
A13
  Bottom 0.406: J1.18 117.47,127.64 117.47,121.92 118.11,121.28 126.36,121.28 129.54,118.75 IC2.13
A14
  Bottom 0.406: J1.19 118.75,122.56 119.38,121.92 129.54,121.92 132.08,119.38 IC2.12
A15
  Bottom 0.406: J1.20 120.02,127.64 120.02,123.83 120.65,123.19 132.08,123.19 134.62,120.65 IC2.11
ACTIVE_PHASE
  Bottom 0.406: L_J10.40 85.09,45.09 85.09,37.47 85.72,36.83 103.5,36.83 104.14,37.47 133.35,37.47 139.7,43.81 139.7,57.78 139.06,58.42 IC7.9
ACTIVE_PHASE_3V3
  Bottom 0.406: J2.1 153.03,73.66 152.4,73.03 152.4,56.52 151.76,55.88 IC7.11
CK1_OUT
  Bottom 0.406: L_J10.37 82.55,42.55 82.55,36.2 83.19,35.56 103.5,35.56 104.78,36.83 137.79,36.83 141.6,40.64 141.6,62.87 140.97,63.5 IC7.7
CK1_OUT_3V3
  Bottom 0.406: J2.3 151.76,78.74 151.13,78.11 151.13,61.59 150.5,60.96 IC7.13
CK2_IN
  Bottom 0.406: IC3.2 141.6,116.2 141.6,119.38 137.79,123.19 TP3.P$1
CK2_OUT  (via drill 0.5 pad 0.41)
  Top 0.406: L_J10.38 82.55,45.09 82.55,36.83 83.19,36.2 102.87,36.2 104.14,37.47 135.89,37.47 v136.53,38.1
  Bottom 0.406: v136.53,38.1 140.97,42.55 140.97,60.33 140.34,60.96 IC7.8
CK2_OUT_3V3
  Bottom 0.406: J2.2 152.4,76.2 151.76,75.56 151.76,59.05 151.13,58.42 IC7.12
CLK_3V
  Top 0.406: L_J9.11 48.26,29.84 47.62,29.21 36.2,29.21 34.92,27.94 34.92,19.68 33.66,18.41 29.84,18.41 R2.1
  Bottom 0.406: R2.1 Q1.D
CLK_5V
  Bottom 0.406: R1.1 R3.2 17.14,14.61 20.32,17.78 Q1.G
COUNT0_CLK  (via drill 0.5 pad 0.41)
  Top 0.406: L_J7.35 93.98,45.09 97.16,45.09 98.42,46.35 127,46.35 v128.27,45.09
  Bottom 0.406: IC7.2 135.89,76.2 134.62,74.93 134.62,46.99 132.72,45.09 v128.27,45.09
COUNT0_CLK_DRV
  Bottom 0.406: J4.3 150.5,104.14 149.86,103.5 149.86,93.98 147.96,92.08 147.96,74.3 147.32,73.66 IC7.18
COUNT0_DATA  (via drill 0.5 pad 0.41)
  Top 0.406: L_J7.36 97.79,43.81 99.69,45.72 125.73,45.72 127.64,43.81 133.35,43.81 v133.99,44.45
  Bottom 0.406: IC7.3 135.89,73.66 135.25,73.03 135.25,45.72 v133.99,44.45
COUNT0_DATA_DRV
  Bottom 0.406: J4.1 151.13,99.06 150.5,98.42 150.5,93.34 148.59,91.44 148.59,71.75 147.96,71.12 IC7.17
COUNT1_CLK  (via drill 0.5 pad 0.41)
  Top 0.406: L_J7.37 93.98,42.55 98.42,42.55 100.97,45.09 125.09,45.09 127,43.18 v134.62,43.18
  Bottom 0.406: IC7.4 136.53,71.12 135.89,70.48 135.89,44.45 v134.62,43.18
COUNT1_CLK_DRV
  Bottom 0.406: J5.3 152.4,92.71 149.22,89.53 149.22,69.22 148.59,68.58 IC7.16
COUNT1_DATA  (via drill 0.5 pad 0.41)
  Top 0.406: L_J7.38 99.06,41.27 102.23,44.45 124.46,44.45 126.36,42.55 132.72,42.55 133.35,41.91 v135.89,41.91
  Bottom 0.406: IC7.5 137.16,68.58 136.53,67.94 136.53,42.55 v135.89,41.91
COUNT1_DATA_DRV
  Bottom 0.406: J5.1 150.5,87.63 149.86,87 149.86,66.67 149.22,66.04 IC7.15
CS_N
  Top 0.406: J1.1 95.89,123.83 97.16,122.56 134.62,122.56 135.89,121.28 135.89,116.2 138.43,113.67 138.43,111.12 139.06,110.49 IC3.4
GND
  Bottom 0.406: R40.2 106.05,106.05 IC4.10 | J1.4 J1.2 | J7.10 J7.11
  Bottom 1.016: J7.11 48.9,118.75 49.53,118.11 51.44,118.11 52.07,117.47 IC5.19
  pour Route2: 3.17,129.54 156.21,129.54 156.21,3.17 3.17,3.17
IN_0  (via drill 0.5 pad 1.02)
  Top 0.406: v148.59,46.35 154.94,46.35 J9.2
  Bottom 0.406: L_J10.19 59.69,42.55 59.69,9.53 60.33,8.26 131.44,8.26 | 131.44,8.26 146.69,8.26 147.32,8.89 147.32,17.78 R66.2 v148.59,46.35 | TP11.P$1 131.44,8.26
IN_1  (via drill 0.5 pad 1.02)
  Top 0.406: L_J10.20 59.69,45.09 59.69,31.11 60.33,30.48 139.7,30.48 140.97,31.75 140.97,38.1 v146.05,43.18 147.96,45.09 J9.3 | TP12.P$1 135.89,11.43 136.53,12.06 144.15,12.06 144.78,12.7 144.78,17.78 R65.2
  Bottom 0.406: R65.2 v146.05,43.18
IN_2  (via drill 0.5 pad 1.02)
  Top 0.406: v143.51,38.73 148.59,43.81 154.94,43.81 J9.4 | v140.97,9.53 140.97,4.45 TP13.P$1
  Bottom 0.406: L_J10.21 62.23,42.55 62.23,9.53 62.87,8.89 140.34,8.89 v140.97,9.53 142.24,10.79 142.24,17.78 R64.2 v143.51,38.73
IN_3  (via drill 0.5 pad 1.02)
  Top 0.406: L_J10.22 62.23,45.09 62.23,31.75 62.87,31.11 138.43,31.11 v139.06,31.75 | v140.97,29.21 141.6,29.21 142.88,30.48 142.88,36.2 149.22,42.55 J9.5 | TP14.P$1 144.78,10.16 144.15,10.79 v139.7,10.79
  Bottom 0.406: v139.06,31.75 139.06,30.48 v140.97,29.21 R63.2 139.7,17.78 v139.7,10.79
IN_4  (via drill 0.5 pad 1.02)
  Top 0.406: v138.43,27.94 139.06,27.3 142.24,27.3 143.51,28.57 143.51,35.56 149.22,41.27 154.94,41.27 J9.6
  Bottom 0.406: L_J10.23 64.77,42.55 64.77,10.16 65.41,9.53 136.53,9.53 137.16,10.16 137.16,17.78 R62.2 v138.43,27.94
IN_5  (via drill 0.5 pad 1.02)
  Top 0.406: L_J10.24 64.77,45.09 64.77,32.38 65.41,31.75 135.25,31.75 v135.89,32.38 | v135.89,27.3 136.53,26.67 142.88,26.67 144.15,27.94 144.15,34.92 149.22,40.01 J9.7
  Bottom 0.406: R61.2 v135.89,27.3 v135.89,32.38
IN_6  (via drill 0.5 pad 1.02)
  Top 0.406: v133.35,26.67 133.99,26.04 143.51,26.04 144.78,27.3 144.78,34.29 149.22,38.73 154.94,38.73 J9.8
  Bottom 0.406: L_J10.25 67.31,42.55 67.31,10.79 67.94,10.16 131.44,10.16 132.08,10.79 132.08,17.78 R60.2 v133.35,26.67
IN_7  (via drill 0.5 pad 1.02)
  Top 0.406: L_J10.26 67.31,45.09 67.31,33.02 67.94,32.38 130.18,32.38 v130.81,33.02 | v130.81,26.04 131.44,25.4 144.15,25.4 145.41,26.67 145.41,33.66 149.22,37.47 J9.9
  Bottom 0.406: R59.2 v130.81,26.04 v130.81,33.02
IN_8  (via drill 0.5 pad 1.02)
  Top 0.406: v128.27,25.4 128.91,24.77 144.78,24.77 146.05,26.04 146.05,33.02 146.69,33.66 154.94,33.66 J9.12
  Bottom 0.406: L_J10.27 69.85,42.55 69.85,11.43 70.48,10.79 126.36,10.79 127,11.43 127,17.78 R58.2 v128.27,25.4
IN_9  (via drill 0.5 pad 1.02)
  Top 0.406: L_J10.28 69.85,45.09 69.85,33.66 70.48,33.02 125.09,33.02 v125.73,33.66 | v125.73,24.77 126.36,24.13 145.41,24.13 146.69,25.4 146.69,31.75 147.32,32.38 J9.13
  Bottom 0.406: R57.2 v125.73,24.77 v125.73,33.66
IN_10  (via drill 0.5 pad 1.02)
  Top 0.406: v123.19,24.13 123.83,23.5 146.05,23.5 147.32,24.77 147.32,30.48 147.96,31.11 154.94,31.11 J9.14
  Bottom 0.406: L_J10.29 72.39,42.55 72.39,12.06 73.03,11.43 121.28,11.43 121.92,12.06 121.92,17.78 R56.2 v123.19,24.13
IN_11  (via drill 0.5 pad 1.02)
  Top 0.406: L_J10.30 72.39,45.09 72.39,34.29 73.03,33.66 120.02,33.66 v120.65,34.29 | v120.65,23.5 121.28,22.86 146.69,22.86 147.96,24.13 147.96,29.21 148.59,29.84 J9.15
  Bottom 0.406: R55.2 v120.65,23.5 v120.65,34.29
IN_12  (via drill 0.5 pad 1.02)
  Top 0.406: v118.11,22.86 118.75,22.23 147.32,22.23 148.59,23.5 148.59,27.94 149.22,28.57 154.94,28.57 J9.16
  Bottom 0.406: L_J10.31 74.93,42.55 74.93,12.7 75.56,12.06 116.2,12.06 116.84,12.7 116.84,17.78 R54.2 v118.11,22.86
IN_13  (via drill 0.5 pad 1.02)
  Top 0.406: L_J10.32 74.93,45.09 74.93,34.92 75.56,34.29 114.94,34.29 v115.57,34.92 | v115.57,22.23 116.2,21.59 147.96,21.59 149.22,22.86 149.22,26.67 149.86,27.3 J9.17
  Bottom 0.406: R53.2 v115.57,22.23 v115.57,34.92
IN_14  (via drill 0.5 pad 1.02)
  Top 0.406: v113.03,21.59 113.67,20.95 148.59,20.95 149.86,22.23 149.86,25.4 150.5,26.04 154.94,26.04 J9.18
  Bottom 0.406: L_J10.33 77.47,42.55 77.47,13.34 78.11,12.7 111.12,12.7 111.76,13.34 111.76,17.78 R52.2 v113.03,21.59
IN_15  (via drill 0.5 pad 1.02)
  Top 0.406: L_J10.34 77.47,45.09 77.47,35.56 78.11,34.92 109.86,34.92 v110.49,35.56 | v110.49,20.32 149.22,20.32 150.5,21.59 150.5,24.13 151.13,24.77 J9.19
  Bottom 0.406: R51.2 v110.49,20.32 v110.49,35.56
INT_MASK_0
  Bottom 0.406: J12.2 5.08,89.53 7.62,89.53 8.89,88.27 8.89,59.05 10.16,57.78 30.48,57.78 L_J4.26
INT_MASK_1
  Bottom 0.406: J12.3 8.89,90.81 10.16,89.53 10.16,61.59 11.43,60.33 27.94,60.33 L_J4.23
INT_MASK_2
  Bottom 0.406: J12.4 5.08,92.08 10.16,92.08 11.43,90.81 11.43,64.14 12.7,62.87 27.94,62.87 L_J4.21
INT_MASK_3
  Bottom 0.406: J12.5 11.43,93.34 12.7,92.08 12.7,66.67 13.97,65.41 27.94,65.41 L_J4.19
INT_MASK_4
  Bottom 0.406: J12.6 5.08,94.61 12.7,94.61 13.97,93.34 13.97,69.22 15.24,67.94 27.94,67.94 L_J4.17
INT_MASK_5
  Bottom 0.406: J12.7 13.97,95.89 15.24,94.61 15.24,71.75 16.51,70.48 27.94,70.48 L_J4.15
INT_MASK_6
  Bottom 0.406: J12.8 5.08,97.16 15.24,97.16 16.51,95.89 16.51,74.3 17.78,73.03 27.94,73.03 L_J4.13
INT_MASK_7
  Bottom 0.406: J12.9 16.51,98.42 17.78,97.16 17.78,76.83 19.05,75.56 27.94,75.56 L_J4.11
INT_STATUS_0
  Bottom 0.406: L_J4.36 30.48,42.55 23.5,42.55 21.59,40.64 21.59,32.38 20.32,31.11 5.08,31.11 J3.2
INT_STATUS_1  (via drill 0.5 pad 1.02)
  Top 0.406: L_J4.35 27.94,42.55 22.23,42.55 20.95,41.27 20.95,33.66 v19.68,32.38
  Bottom 0.406: J3.3 v19.68,32.38
INT_STATUS_2
  Bottom 0.406: L_J4.34 30.48,45.09 21.59,45.09 20.32,43.81 20.32,34.92 19.05,33.66 5.08,33.66 J3.4
INT_STATUS_3  (via drill 0.5 pad 1.02)
  Top 0.406: L_J4.33 27.94,45.09 20.95,45.09 19.68,43.81 19.68,36.2 v18.41,34.92
  Bottom 0.406: J3.5 v18.41,34.92
INT_STATUS_4
  Bottom 0.406: L_J4.32 30.48,47.62 20.32,47.62 19.05,46.35 19.05,37.47 17.78,36.2 5.08,36.2 J3.6
INT_STATUS_5  (via drill 0.5 pad 1.02)
  Top 0.406: L_J4.31 27.94,47.62 19.68,47.62 18.41,46.35 18.41,38.73 v17.14,37.47
  Bottom 0.406: J3.7 v17.14,37.47
INT_STATUS_6
  Bottom 0.406: L_J4.30 30.48,50.16 19.05,50.16 17.78,48.9 17.78,40.01 16.51,38.73 5.08,38.73 J3.8
INT_STATUS_7  (via drill 0.5 pad 1.02)
  Top 0.406: L_J4.29 27.94,50.16 18.41,50.16 17.14,48.9 17.14,41.27 v15.88,40.01
  Bottom 0.406: v15.88,40.01 J3.9
N$1
  Bottom 0.406: R5.1 IC7.1
N$3
  Bottom 0.406: OSC1.5 19.05,20.95 R1.2
N$15  (via drill 0.5 pad 0.41)
  Top 0.406: v111.12,41.91 121.28,41.91 J22.4
  Bottom 0.406: IC8.19 111.12,56.52 v111.12,41.91
N$16  (via drill 0.5 pad 0.41)
  Top 0.406: v113.67,43.18 122.56,43.18 J22.5
  Bottom 0.406: IC8.18 113.67,56.52 v113.67,43.18
N$17
  Bottom 0.406: IC8.4 J22.1
N$44  (via drill 0.5 pad 1.02)
  Top 0.406: v133.35,113.67 v111.76,113.67 v80.64,113.67 v49.53,113.67
  Bottom 0.406: v111.76,113.67 IC2.1 R40.1 | v133.35,113.67 137.16,113.67 138.43,114.94 138.43,118.11 IC3.1 | IC5.1 v49.53,113.67 | IC4.1 v80.64,113.67
N$46
  Bottom 0.406: IC1.1 R41.1
OUT_0  (via drill 0.5 pad 1.02)
  Top 0.406: v36.83,18.41 73.03,18.41 73.66,17.78 107.31,17.78 107.95,17.14 107.95,13.34 108.58,12.7 114.94,12.7 115.57,12.06 115.57,5.08 J11.2
  Bottom 0.406: L_J10.3 36.83,42.55 v36.83,18.41 36.83,17.14 50.16,3.81 TP4.P$1
OUT_1  (via drill 0.5 pad 1.02)
  Top 0.406: v39.37,17.14 40.01,17.78 72.39,17.78 73.03,17.14 106.68,17.14 107.31,16.51 107.31,12.7 107.95,12.06 113.67,12.06 114.3,11.43 J11.3
  Bottom 0.406: L_J10.4 39.37,45.09 v39.37,17.14 39.37,15.88 49.53,5.71 71.75,5.71 72.39,5.08 TP5.P$1
OUT_2  (via drill 0.5 pad 1.02)
  Top 0.406: v41.91,16.51 42.55,17.14 71.75,17.14 72.39,16.51 106.05,16.51 106.68,15.88 106.68,12.06 107.31,11.43 112.39,11.43 113.03,10.79 113.03,5.08 J11.4 | v41.91,34.29 41.91,42.55 L_J10.5
  Bottom 0.406: v41.91,34.29 v41.91,16.51 41.91,14.61 50.16,6.35 74.93,6.35 76.83,4.45 TP6.P$1
OUT_3  (via drill 0.5 pad 1.02)
  Top 0.406: v43.18,15.88 43.81,16.51 71.12,16.51 71.75,15.88 105.41,15.88 106.05,15.24 106.05,11.43 106.68,10.79 111.12,10.79 111.76,10.16 J11.5
  Bottom 0.406: L_J10.6 41.91,45.09 41.91,36.2 43.18,34.92 v43.18,15.88 43.18,14.61 50.8,6.99 78.74,6.99 81.28,4.45 TP9.P$1
OUT_4  (via drill 0.5 pad 1.02)
  Top 0.406: v44.45,15.24 45.09,15.88 70.48,15.88 71.12,15.24 104.78,15.24 105.41,14.61 105.41,10.79 106.05,10.16 109.86,10.16 110.49,9.53 110.49,5.08 J11.6 | v44.45,34.29 44.45,42.55 L_J10.7
  Bottom 0.406: v44.45,15.24 v44.45,34.29
OUT_5  (via drill 0.5 pad 1.02)
  Top 0.406: v45.72,14.61 46.35,15.24 69.85,15.24 70.48,14.61 104.14,14.61 104.78,13.97 104.78,10.16 105.41,9.53 108.58,9.53 109.22,8.89 J11.7
  Bottom 0.406: v45.72,14.61 45.72,34.92 44.45,36.2 44.45,45.09 L_J10.8
OUT_6  (via drill 0.5 pad 1.02)
  Top 0.406: v46.99,13.97 47.62,14.61 69.22,14.61 69.85,13.97 103.5,13.97 104.14,13.34 104.14,9.53 104.78,8.89 107.31,8.89 107.95,8.26 107.95,5.08 J11.8 | v46.99,34.29 46.99,42.55 L_J10.9
  Bottom 0.406: v46.99,13.97 v46.99,34.29
OUT_7  (via drill 0.5 pad 1.02)
  Top 0.406: v48.26,13.34 48.9,13.97 68.58,13.97 69.22,13.34 102.87,13.34 103.5,12.7 103.5,8.89 104.14,8.26 106.05,8.26 106.68,7.62 J11.9
  Bottom 0.406: v48.26,13.34 48.26,34.92 46.99,36.2 46.99,45.09 L_J10.10
OUT_8  (via drill 0.5 pad 1.02)
  Top 0.406: v49.53,12.7 50.16,13.34 67.94,13.34 68.58,12.7 102.23,12.7 102.87,12.06 102.87,5.08 J11.12 | v49.53,23.5 49.53,42.55 L_J10.11
  Bottom 0.406: v49.53,12.7 v49.53,23.5
OUT_9  (via drill 0.5 pad 1.02)
  Top 0.406: v50.8,12.06 51.44,12.7 67.31,12.7 67.94,12.06 100.97,12.06 101.6,11.43 J11.13
  Bottom 0.406: v50.8,12.06 50.8,25.4 49.53,26.67 49.53,45.09 L_J10.12
OUT_10  (via drill 0.5 pad 1.02)
  Top 0.406: v52.07,11.43 52.7,12.06 66.67,12.06 67.31,11.43 99.69,11.43 100.33,10.79 100.33,5.08 J11.14 | v52.07,23.5 52.07,42.55 L_J10.13
  Bottom 0.406: v52.07,11.43 v52.07,23.5
OUT_11  (via drill 0.5 pad 1.02)
  Top 0.406: v53.34,10.79 53.98,11.43 66.04,11.43 66.67,10.79 98.42,10.79 99.06,10.16 J11.15
  Bottom 0.406: v53.34,10.79 53.34,25.4 52.07,26.67 52.07,45.09 L_J10.14
OUT_12  (via drill 0.5 pad 1.02)
  Top 0.406: v54.61,10.16 55.24,10.79 65.41,10.79 66.04,10.16 97.16,10.16 97.79,9.53 97.79,5.08 J11.16 | v54.61,23.5 54.61,42.55 L_J10.15
  Bottom 0.406: v54.61,10.16 v54.61,23.5
OUT_13  (via drill 0.5 pad 1.02)
  Top 0.406: v55.88,9.53 56.52,10.16 64.77,10.16 65.41,9.53 95.89,9.53 96.52,8.89 J11.17
  Bottom 0.406: v55.88,9.53 55.88,25.4 54.61,26.67 54.61,45.09 L_J10.16
OUT_14  (via drill 0.5 pad 1.02)
  Top 0.406: v57.15,8.89 57.78,9.53 64.14,9.53 64.77,8.89 94.61,8.89 95.25,8.26 95.25,5.08 J11.18 | v57.15,23.5 57.15,42.55 L_J10.17
  Bottom 0.406: v57.15,8.89 v57.15,23.5
OUT_15  (via drill 0.5 pad 1.02)
  Top 0.406: v58.42,8.26 93.34,8.26 93.98,7.62 J11.19
  Bottom 0.406: v58.42,8.26 58.42,25.4 57.15,26.67 57.15,45.09 L_J10.18
RD0
  Bottom 0.406: J7.2 37.47,127.64 37.47,124.46 36.83,123.83 24.13,123.83 23.5,123.19 IC1.18
RD1
  Bottom 0.406: J7.3 38.73,123.83 38.1,123.19 26.67,123.19 26.04,122.56 IC1.17
RD2
  Bottom 0.406: J7.4 40.01,127.64 40.01,123.19 39.37,122.56 29.21,122.56 28.57,121.92 IC1.16
RD3
  Bottom 0.406: J7.5 41.27,122.56 40.64,121.92 31.75,121.92 31.11,121.28 IC1.15
RD4
  Bottom 0.406: J7.6 42.55,127.64 42.55,121.92 41.91,121.28 34.29,121.28 33.66,120.65 IC1.14
RD5
  Bottom 0.406: J7.7 43.81,121.28 43.18,120.65 36.83,120.65 36.2,120.02 IC1.13
RD6
  Bottom 0.406: J7.8 45.09,127.64 45.09,120.65 44.45,120.02 39.37,120.02 38.73,119.38 IC1.12
RD7
  Bottom 0.406: J7.9 46.35,120.02 45.72,119.38 41.91,119.38 41.27,118.75 IC1.11
RESET_N  (via drill 0.5 pad 0.41)
  Top 0.406: L_J7.23 93.98,57.78 98.42,57.78 99.69,56.52 119.38,56.52 v120.02,55.88
  Bottom 0.406: v120.02,55.88 IC8.6
SPEED
  Top 0.406: IC8.16 117.47,59.05 118.11,59.69 153.67,59.69 154.94,60.96 TP10.P$1
SPI_CLK
  Top 0.406: L_J7.26 97.79,56.52 99.69,54.61 129.54,54.61 130.18,55.24 IC8.11
SPI_MISO  (via drill 0.5 pad 0.41)
  Top 0.406: L_J7.29 93.98,52.7 v125.09,52.7
  Bottom 0.406: v125.09,52.7 IC8.13
SPI_MOSI
  Top 0.406: L_J7.28 127,53.98 127.64,53.34 IC8.9
UART_RX
  Bottom 0.406: IC8.12 127.64,59.69 130.81,62.87 130.81,88.9 132.08,90.17 140.34,90.17 142.24,92.08 142.24,114.94 144.15,116.84 153.67,116.84 J6.3
UART_TX
  Bottom 0.406: IC8.10 130.18,51.44 131.44,52.7 131.44,88.27 132.72,89.53 140.97,89.53 142.88,91.44 142.88,113.03 144.15,114.3 149.86,114.3 151.13,113.03 151.13,111.12 151.76,110.49 J6.1
USER_INT
  Bottom 0.406: TP2.P$1 13.34,121.28 R39.1 19.05,121.28 19.68,120.65 19.68,78.74 20.32,78.11 27.94,78.11 L_J4.9
USER_RESET  (via drill 0.5 pad 0.41)
  Top 0.406: L_J10.36 80.01,45.09 80.01,36.2 80.64,35.56 103.5,35.56 104.78,36.83 v139.7,36.83
  Bottom 0.406: v139.7,36.83 142.24,39.37 142.24,65.41 141.6,66.04 IC7.6
USER_RESET_3V3
  Bottom 0.406: J2.4 151.13,81.28 150.5,80.64 150.5,64.14 149.86,63.5 IC7.14
WD0
  Bottom 0.406: J7.12 50.16,127.64 50.16,120.02 50.8,119.38 53.98,119.38 54.61,118.75 IC5.18
WD1
  Bottom 0.406: J7.13 51.44,120.65 52.07,120.02 56.52,120.02 57.15,119.38 IC5.17
WD2
  Bottom 0.406: J7.14 52.7,127.64 52.7,121.28 53.34,120.65 59.05,120.65 59.69,120.02 IC5.16
WD3
  Bottom 0.406: J7.15 53.98,121.92 54.61,121.28 61.59,121.28 62.23,120.65 IC5.15
WD4
  Bottom 0.406: J7.16 55.24,127.64 55.24,122.56 55.88,121.92 64.14,121.92 64.77,121.28 IC5.14
WD5
  Bottom 0.406: J7.17 56.52,123.19 57.15,122.56 66.67,122.56 67.31,121.92 IC5.13
WD6
  Bottom 0.406: J7.18 57.78,127.64 57.78,123.83 58.42,123.19 69.22,123.19 69.85,122.56 IC5.12
WD7
  Bottom 0.406: J7.19 59.05,124.46 59.69,123.83 71.75,123.83 72.39,123.19 IC5.11
WRITE_N
  Top 0.406: J1.3 98.42,123.83 99.06,123.19 135.25,123.19 136.53,121.92 136.53,116.84 IC3.3

## Text on the board
tPlace: CK2 | UInt | R | T | UART | 7S0 | C | IGOR_1 | James Newman | D | 7S1 | C | D | R | 1 | 2 | CTRL | A | Spd | Gnd | O0 | O1 | O2 | O3 | I0 | I1 | I2 | I3 | 0 | 3.3 | +5